# EAGLE design amp_pt2322_v_1_0 (EAGLE 9.2.2)
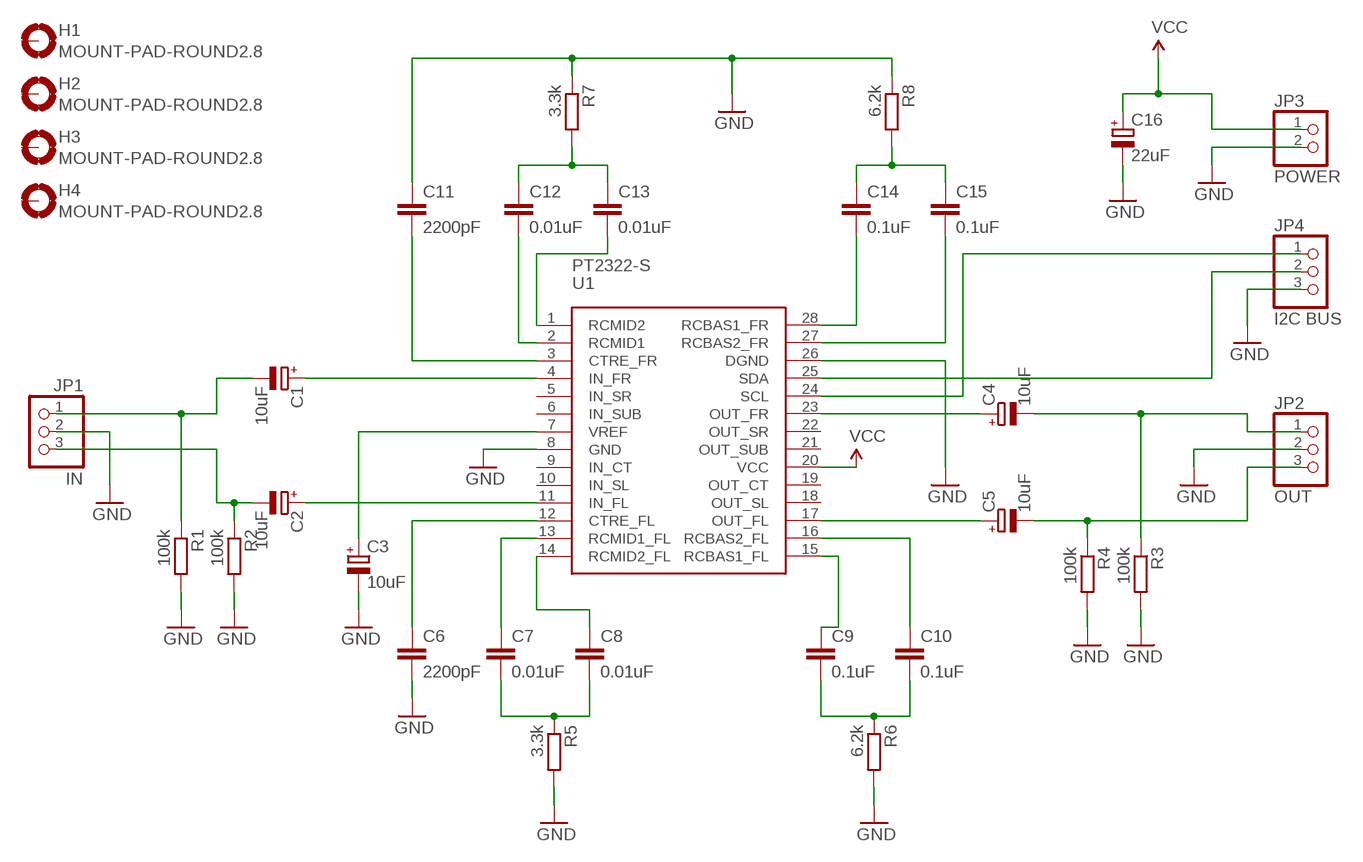
[diagram p0: schematic, sheet 1]

## Parts
C1  10uF  CPOL-EUSMCB  [SMC_B]
C2  10uF  CPOL-EUSMCB  [SMC_B]
C3  10uF  CPOL-EUSMCB  [SMC_B]
C4  10uF  CPOL-EUSMCB  [SMC_B]
C5  10uF  CPOL-EUSMCB  [SMC_B]
C6  2200pF  C-EUC0805K  [C0805K]
C7  0.01uF  C-EUC0805K  [C0805K]
C8  0.01uF  C-EUC0805K  [C0805K]
C9  0.1uF  C-EUC0805K  [C0805K]
C10  0.1uF  C-EUC0805K  [C0805K]
C11  2200pF  C-EUC0805K  [C0805K]
C12  0.01uF  C-EUC0805K  [C0805K]
C13  0.01uF  C-EUC0805K  [C0805K]
C14  0.1uF  C-EUC0805K  [C0805K]
C15  0.1uF  C-EUC0805K  [C0805K]
C16  22uF  CPOL-EUSMCB  [SMC_B]
H1  MOUNT-PAD-ROUND2.8  [2,8-PAD]
H2  MOUNT-PAD-ROUND2.8  [2,8-PAD]
H3  MOUNT-PAD-ROUND2.8  [2,8-PAD]
H4  MOUNT-PAD-ROUND2.8  [2,8-PAD]
JP1  IN  PINHD-1X3  [1X03]
JP2  OUT  PINHD-1X3  [1X03]
JP3  POWER  PINHD-1X2  [1X02]
JP4  I2C BUS  PINHD-1X3  [1X03]
R1  100k  R-EU_R0805  [R0805]
R2  100k  R-EU_R0805  [R0805]
R3  100k  R-EU_R0805  [R0805]
R4  100k  R-EU_R0805  [R0805]
R5  3.3k  R-EU_R0805  [R0805]
R6  6.2k  R-EU_R0805  [R0805]
R7  3.3k  R-EU_R0805  [R0805]
R8  6.2k  R-EU_R0805  [R0805]
U1  PT2322-S  [SOP28]

## Nets
GND: C3.- C6.2 C11.1 C16.- JP1.2 JP2.2 JP3.2 JP4.3 R1.2 R2.2 R3.2 R4.2 R5.2 R6.2 R7.1 R8.1 U1.8(GND) U1.26(DGND)
N$1: C1.+ U1.4(IN_FR)
N$2: C2.+ U1.11(IN_FL)
N$3: C1.- JP1.1 R1.1
N$4: C2.- JP1.3 R2.1
N$5: C3.+ U1.7(VREF)
N$6: C6.1 U1.12(CTRE_FL)
N$7: C7.1 U1.13(RCMID1_FL)
N$8: C8.1 U1.14(RCMID2_FL)
N$9: C7.2 C8.2 R5.1
N$10: C10.1 U1.16(RCBAS2_FL)
N$11: C9.1 U1.15(RCBAS1_FL)
N$12: C9.2 C10.2 R6.1
N$13: C13.2 U1.1(RCMID2)
N$14: C12.2 U1.2(RCMID1)
N$15: C11.2 U1.3(CTRE_FR)
N$16: C12.1 C13.1 R7.2
N$18: C14.2 U1.28(RCBAS1_FR)
N$19: C15.2 U1.27(RCBAS2_FR)
N$20: C14.1 C15.1 R8.2
N$21: C4.+ U1.23(OUT_FR)
N$22: C5.+ U1.17(OUT_FL)
N$23: C4.- JP2.1 R3.1
N$24: C5.- JP2.3 R4.1
N$41: JP4.1 U1.24(SCL)
N$42: JP4.2 U1.25(SDA)
VCC: C16.+ JP3.1 U1.20(VCC)
Unconnected: H1.B2,8(MOUNT) H2.B2,8(MOUNT) H3.B2,8(MOUNT) H4.B2,8(MOUNT) U1.5(IN_SR) U1.6(IN_SUB) U1.9(IN_CT) U1.10(IN_SL) U1.18(OUT_SL) U1.19(OUT_CT) U1.21(OUT_SUB) U1.22(OUT_SR)

## Library data of the parts
C1-C5 C16 = rcl:CPOL-EU: POLARIZED CAPACITOR, European symbol
C6-C15 = rcl:C-EU: CAPACITOR, European symbol
H1-H4 = holes:MOUNT-PAD-ROUND: MOUNTING PAD, round
JP1 JP2 JP4 = pinhead:PINHD-1X3: PIN HEADER
JP3 = pinhead:PINHD-1X2: PIN HEADER
R1-R8 = rcl:R-EU_: RESISTOR, European symbol
U1 = pt2322:PT2322-S

## Board
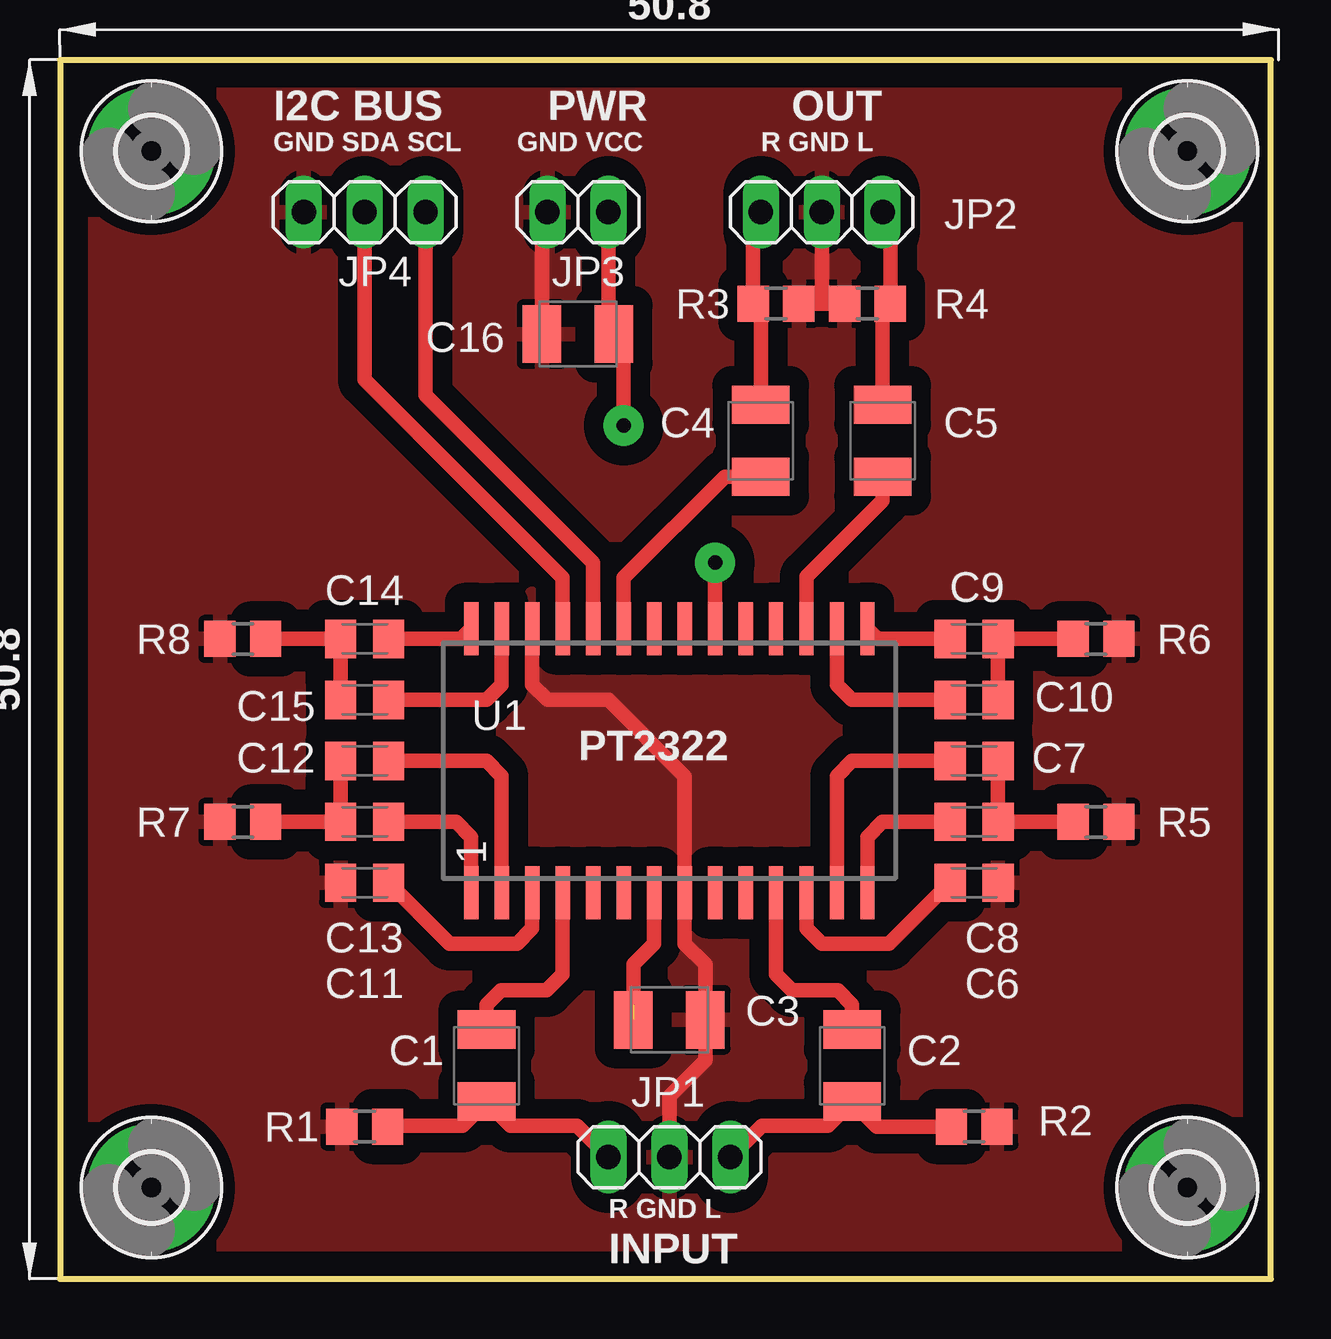
[diagram p1: board, top side]
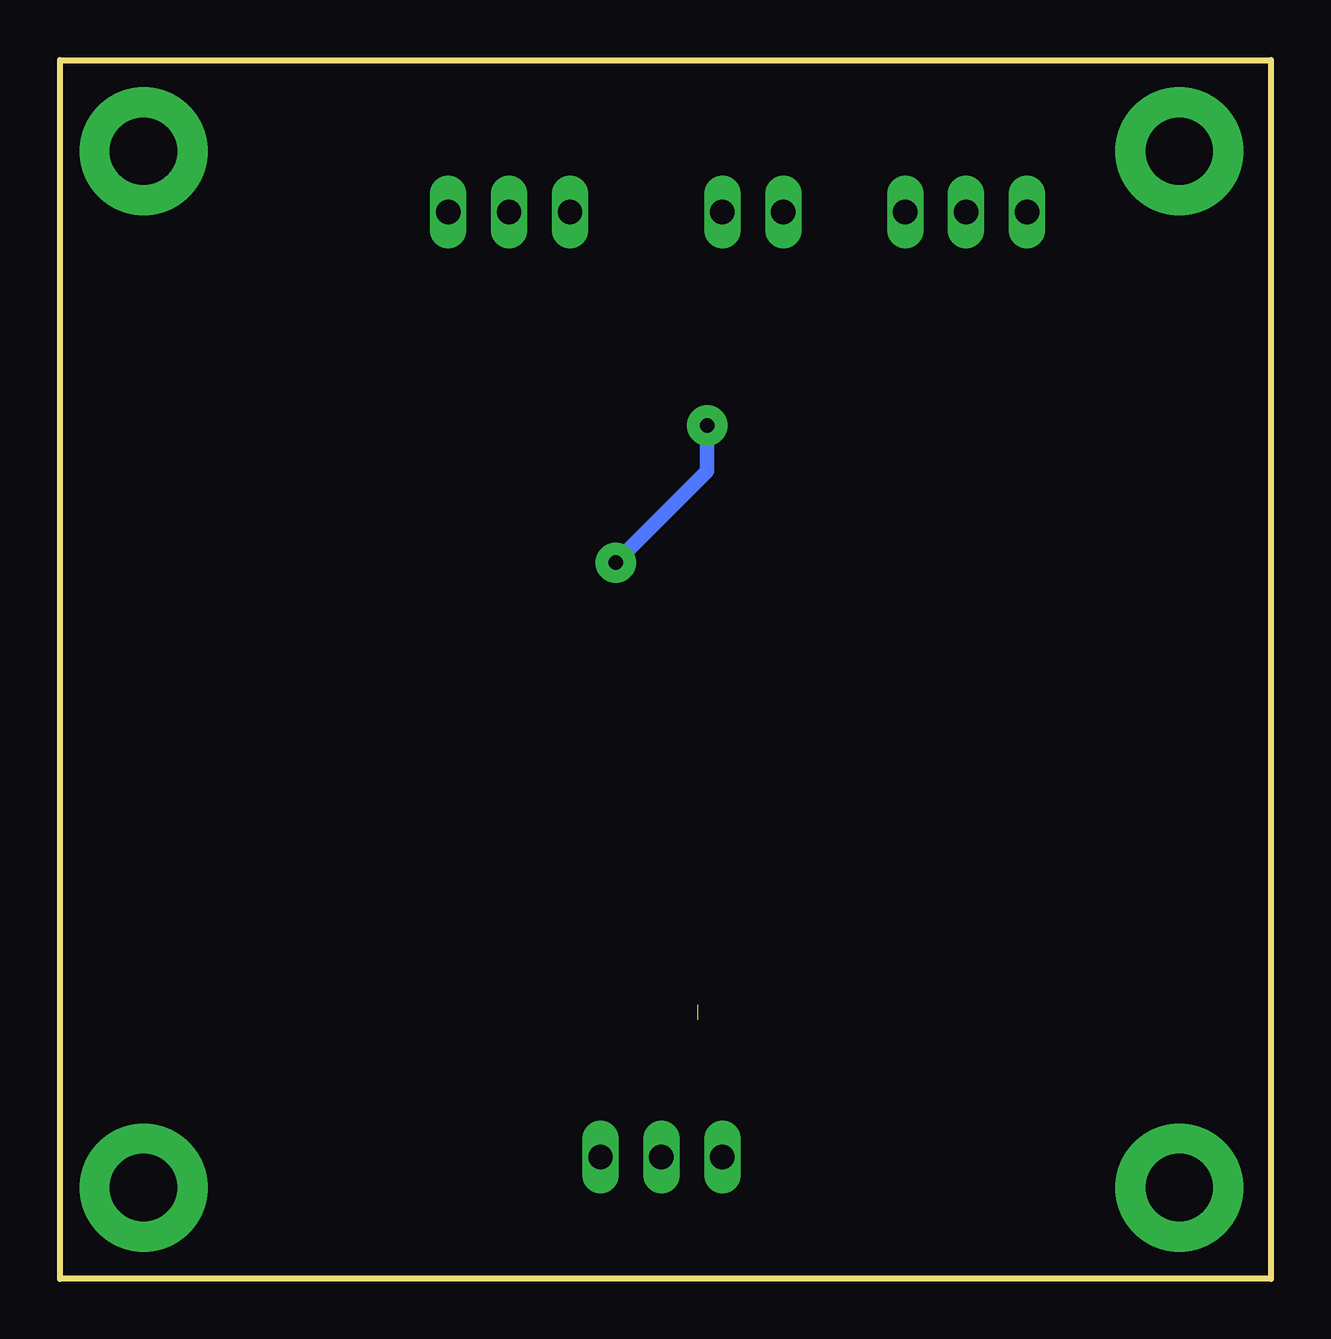
[diagram p2: board, bottom side, seen from below]

Size 50.47 x 50.79 mm. Coordinates in mm from the lower left corner, seen from the top.
Outline: 0,0 50.47,0 50.47,50.79 0,50.79 0,0
Copper layers (1*16): Top 0.035mm / dielectric 1.5mm / Bottom 0.035mm
Design rules "default": minimum track width 10mil, minimum drill 24mil, track to track 8mil, track to pad 8mil, pad to pad 8mil, via to via 8mil, smd to smd 8mil, copper to edge 40mil, drill to drill 8mil, minimum pad ring 10mil, minimum via ring 8mil, stop-mask expansion 4mil, vias tented up to drill 0mil, thermal gap 10mil

### Footprints (pad centres in the part's own frame; a part is rotated, then mirrored left to right if it is on the bottom)
SMC_B = smd 1.6 x 2.4: + -1.5,0; - 1.5,0
C0805K = smd 1.3 x 1.6: 1 -1,0; 2 1,0
2,8-PAD = drill 2.8 pad 5.334: B2,8 0,0
1X03 = drill 1.016 long: 1 -2.54,0; 2 0,0; 3 2.54,0
1X02 = drill 1.016 long: 1 -1.27,0; 2 1.27,0
R0805 = smd 1.3 x 1.5: 1 -0.95,0; 2 0.95,0
SOP28 = smd 0.6 x 2.2: 1 -8.255,-5.5; 2 -6.985,-5.5; 3 -5.715,-5.5; 4 -4.445,-5.5; 5 -3.175,-5.5; 6 -1.905,-5.5; 7 -0.635,-5.5; 8 0.635,-5.5; 9 1.905,-5.5; 10 3.175,-5.5; 11 4.445,-5.5; 12 5.715,-5.5; 13 6.985,-5.5; 14 8.255,-5.5; 15 8.255,5.5; 16 6.985,5.5; 17 5.715,5.5; 18 4.445,5.5; 19 3.175,5.5; 20 1.905,5.5; 21 0.635,5.5; 22 -0.635,5.5; 23 -1.905,5.5; 24 -3.175,5.5; 25 -4.445,5.5; 26 -5.715,5.5; 27 -6.985,5.5; 28 -8.255,5.5

### Placement (x,y rotation side)
C1  17.78,8.89 270 top
C2  33.02,8.89 270 top
C3  25.4,10.79 0 top
C4  29.21,34.92 90 top
C5  34.29,34.92 90 top
C6  38.1,16.51 0 top
C7  38.1,21.59 0 top
C8  38.1,19.05 0 top
C9  38.1,26.67 0 top
C10  38.1,24.13 0 top
C11  12.7,16.51 0 top
C12  12.7,21.59 0 top
C13  12.7,19.05 0 top
C14  12.7,26.67 0 top
C15  12.7,24.13 0 top
C16  21.59,39.37 180 top
H1  3.81,3.81 0 top
H2  46.99,3.81 0 top
H3  3.81,46.99 0 top
H4  46.99,46.99 0 top
JP1  25.4,5.08 0 top
JP2  31.75,44.45 0 top
JP3  21.59,44.45 180 top
JP4  12.7,44.45 180 top
R1  12.7,6.35 180 top
R2  38.1,6.35 0 top
R3  29.84,40.64 0 top
R4  33.66,40.64 180 top
R5  43.18,19.05 0 top
R6  43.18,26.67 0 top
R7  7.62,19.05 0 top
R8  7.62,26.67 0 top
U1  25.4,21.59 0 top

### Tracks (layer width: path | path; a pad name or v marks a point on that pad's centre or on a via)
GND
  Top 0.61: U1.26 19.68,24.77 20.32,24.13 22.86,24.13 26.04,20.95 U1.8 26.04,13.97 26.9,13.11 C3.- 26.9,9.12 25.4,7.62 JP1.2 | JP3.2 20.09,44.22 C16.- | R3.2 31.75,40.64 | 31.75,40.64 R4.2 | JP2.2 31.75,40.64
  pour Top (isolate 0.813): 0,50.8 50.8,50.8 50.8,0 0,0
N$1
  Top 0.61: U1.4 20.95,12.7 20.28,12.03 18.38,12.03 17.78,11.43 C1.+
N$2
  Top 0.61: U1.11 29.84,12.7 30.52,12.03 32.42,12.03 33.02,11.43 C2.+
N$3
  Top 0.61: JP1.1 21.55,6.39 18.78,6.39 C1.- 16.78,6.39 13.69,6.39 R1.1
N$4
  Top 0.61: JP1.3 29.25,6.39 32.02,6.39 C2.- 34.06,6.35 R2.1 37.11,6.39
N$5  (1 unrouted)
  Top 0.61: U1.7 24.77,13.97 23.9,13.11 23.9,11.43
N$6
  Top 0.61: C6.1 34.56,13.97 31.75,13.97 31.11,14.61 U1.12
N$7
  Top 0.61: C7.1 33.02,21.59 32.38,20.95 U1.13
N$8
  Top 0.61: 33.66,15.88 U1.14 33.66,18.41 34.29,19.05 C8.1
N$9
  Top 0.61: C7.2 C8.2 | C8.2 39.42,18.73 | C8.2 R5.1
N$10
  Top 0.61: C10.1 33.02,24.13 32.38,24.77 U1.16
N$11
  Top 0.61: 33.66,27.3 U1.15 34.08,26.67 C9.1
N$12
  Top 0.61: C10.2 C9.2 R6.1
N$13
  Top 0.61: C13.2 16.51,19.05 17.14,18.41 U1.1
N$14
  Top 0.61: C12.2 17.78,21.59 18.41,20.95 U1.2
N$15
  Top 0.61: C11.2 16.24,13.97 19.05,13.97 19.68,14.61 U1.3
N$16
  Top 0.61: C12.1 C13.1 R7.2
N$18
  Top 0.61: 17.14,27.3 U1.28 16.73,26.67 C14.2
N$19
  Top 0.61: U1.27 18.41,24.77 17.78,24.13 C15.2
N$20
  Top 0.61: C15.1 C14.1 | 11.63,26.6 C14.1 | C14.1 R8.2
N$21
  Top 0.61: U1.23 23.5,29.21 27.71,33.42 C4.+
N$22
  Top 0.61: U1.17 31.11,29.25 34.29,32.42 C5.+
N$23
  Top 0.61: C4.- 29.21,40.33 R3.1 28.89,44.13 JP2.1
N$24
  Top 0.61: C5.- 34.29,40.33 R4.1 34.6,44.13 JP2.3
N$41
  Top 0.61: U1.24 22.23,29.84 15.24,36.83 JP4.1
N$42
  Top 0.61: U1.25 20.95,29.21 12.7,37.47 JP4.2
VCC  (via drill 0.61 pad 1.68)
  Top 0.61: JP3.1 22.86,39.6 C16.+ 23.5,38.97 v23.5,35.56 | U1.20 v27.3,29.84
  Bottom 0.61: v27.3,29.84 23.5,33.66 v23.5,35.56

### Text on the board
tNames: I2C BUS | PWR | OUT | GND SDA SCL | GND VCC | R GND L | PT2322 | R GND L | INPUT